# Altium schematic sheet Sheet3.SchDoc
size A3; SheetNumber: 3
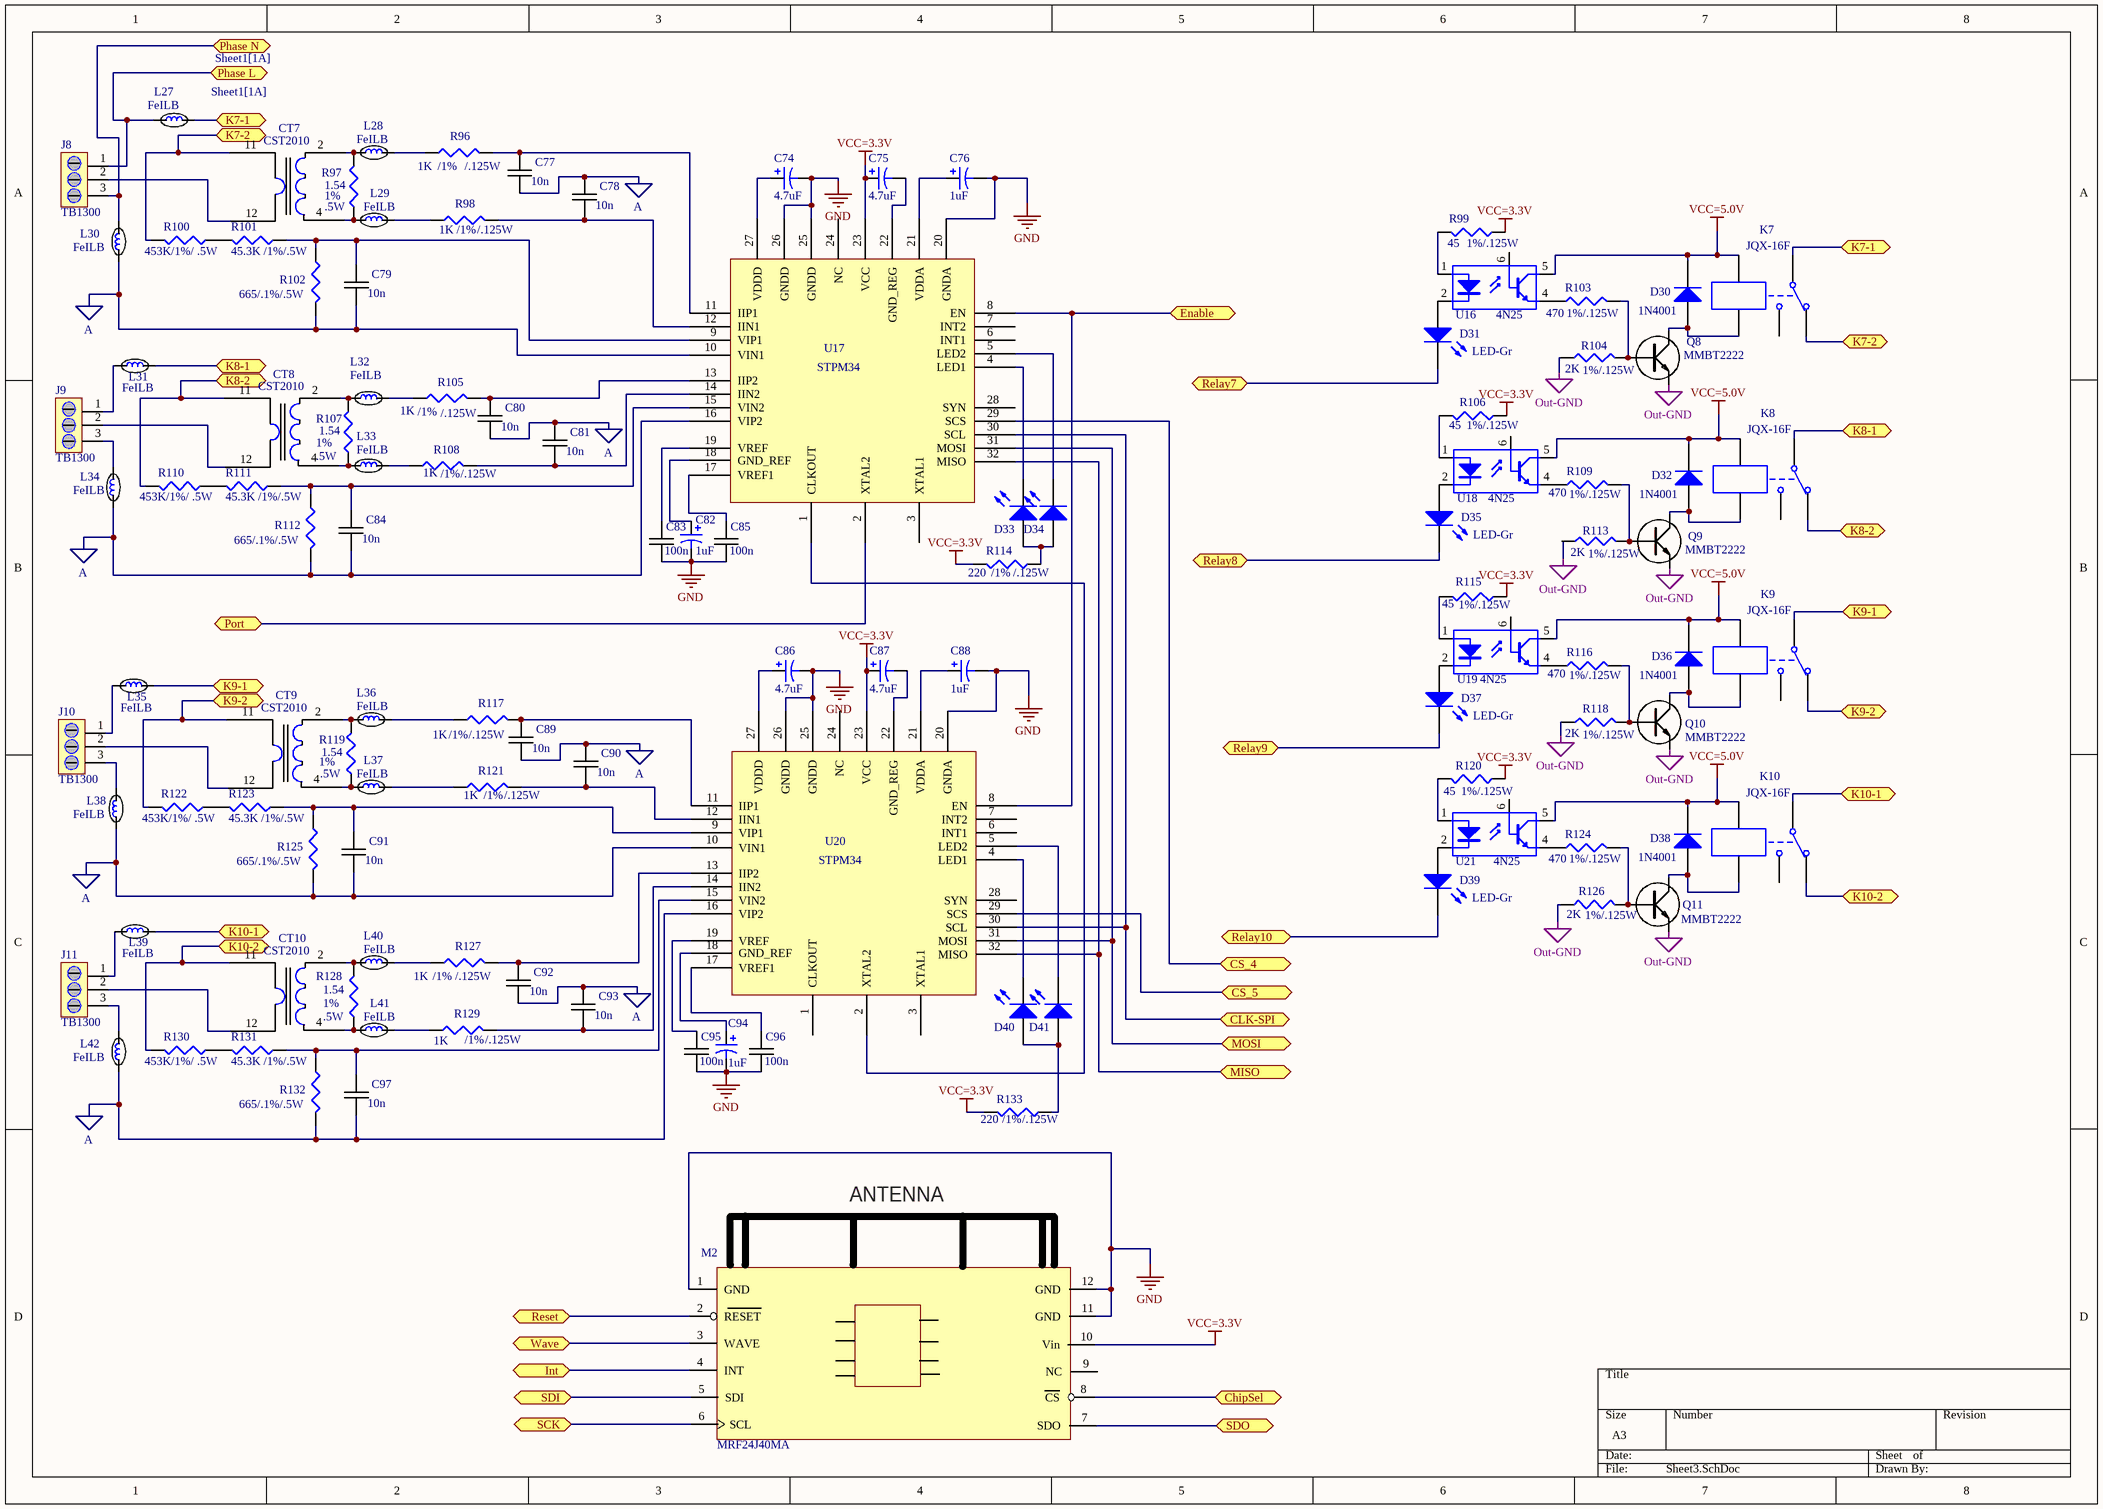
[diagram p0: Sheet3.SchDoc]

## Parts
C74  4.7uF  [C0805]
C75  4.7uF  [C0805]
C76  1uF  [C0805]
C77  10n  [0805C-TBD]
C78  10n  [0805C-TBD]
C79  10n  [0805C-TBD]
C80  10n  [0805C-TBD]
C81  10n  [0805C-TBD]
C82  1uF  [C0805]
C83  100n  [0805C-TBD]
C84  10n  [0805C-TBD]
C85  100n  [0805C-TBD]
C86  4.7uF  [C0805]
C87  4.7uF  [C0805]
C88  1uF  [C0805]
C89  10n  [0805C-TBD]
C90  10n  [0805C-TBD]
C91  10n  [0805C-TBD]
C92  10n  [0805C-TBD]
C93  10n  [0805C-TBD]
C94  1uF  [C0805]
C95  100n  [0805C-TBD]
C96  100n  [0805C-TBD]
C97  10n  [0805C-TBD]
CT7  CST2010  [CST2010]
CT8  CST2010  [CST2010]
CT9  CST2010  [CST2010]
CT10  CST2010  [CST2010]
D30  1N4001  [DO-214AC]
D31  LED-Gr  [3.2X1.6X1.1]
D32  1N4001  [DO-214AC]
D33  LED2  [3.2X1.6X1.1]  (value not drawn)
D34  LED2  [3.2X1.6X1.1]  (value not drawn)
D35  LED-Gr  [3.2X1.6X1.1]
D36  1N4001  [DO-214AC]
D37  LED-Gr  [3.2X1.6X1.1]
D38  1N4001  [DO-214AC]
D39  LED-Gr  [3.2X1.6X1.1]
D40  LED2  [3.2X1.6X1.1]  (value not drawn)
D41  LED2  [3.2X1.6X1.1]  (value not drawn)
J8  TB1300  [TB-1300-0-C]
J9  TB1300  [TB-1300-0-C]
J10  TB1300  [TB-1300-0-C]
J11  TB1300  [TB-1300-0-C]
K7  JQX-16F  [JQX-16f]
K8  JQX-16F  [JQX-16f]
K9  JQX-16F  [JQX-16f]
K10  JQX-16F  [JQX-16f]
L27  FeILB
L28  FeILB
L29  FeILB
L30  FeILB
L31  FeILB
L32  FeILB
L33  FeILB
L34  FeILB
L35  FeILB
L36  FeILB
L37  FeILB
L38  FeILB
L39  FeILB
L40  FeILB
L41  FeILB
L42  FeILB
M2  MRF24J40MA
Q8  MMBT2222  [SOT23-BCE]
Q9  MMBT2222  [SOT23-BCE]
Q10  MMBT2222  [SOT23-BCE]
Q11  MMBT2222  [SOT23-BCE]
R96  1K  [0805R-10]
R97  1.54  [0805R-10]
R98  1K  [0805R-10]
R99  45  [0805R-68]
R100  453K/1%/ .5W  [1210R-GENERIC]
R101  45.3K /1%/.5W  [1210C-GENERIC]
R102  665/.1%/.5W  [1210C-GENERIC]
R103  470  [0805R-39]
R104  2K  [0805R-180]
R105  1K  [0805R-10]
R106  45  [0805R-68]
R107  1.54  [0805R-10]
R108  1K  [0805R-10]
R109  470  [0805R-39]
R110  453K/1%/ .5W  [1210R-GENERIC]
R111  45.3K /1%/.5W  [1210C-GENERIC]
R112  665/.1%/.5W  [1210C-GENERIC]
R113  2K  [0805R-180]
R114  220  [J1-0603]
R115  45  [0805R-68]
R116  470  [0805R-39]
R117  1K  [0805R-10]
R118  2K  [0805R-180]
R119  1.54  [0805R-10]
R120  45  [0805R-68]
R121  1K  [0805R-10]
R122  453K/1%/ .5W  [1210R-GENERIC]
R123  45.3K /1%/.5W  [1210C-GENERIC]
R124  470  [0805R-39]
R125  665/.1%/.5W  [1210C-GENERIC]
R126  2K  [0805R-180]
R127  1K  [0805R-10]
R128  1.54  [0805R-10]
R129  1K  [0805R-10]
R130  453K/1%/ .5W  [1210R-GENERIC]
R131  45.3K /1%/.5W  [1210C-GENERIC]
R132  665/.1%/.5W  [1210C-GENERIC]
R133  220  [J1-0603]
U16  4N25  [4N25]
U17  STPM34  [QFN32_M]
U18  4N25  [4N25]
U19  4N25  [4N25]
U20  STPM34  [QFN32_M]
U21  4N25  [4N25]

## Ports
ChipSel, CLK-SPI, CS_4, CS_5, Enable, Int, K7-1, K7-2, K8-1, K8-2, K9-1, K9-2, K10-1, K10-2, MISO, MOSI, Phase L (see Sheet1[1A]), Phase N (see Sheet1[1A]), Port, Relay7, Relay8, Relay9, Relay10, Reset, SCK, SDI, SDO, Wave

## Nets
A: C77.1 C78.2 C79.1 C80.1 C81.2 C84.1 C89.1 C90.2 C91.1 C92.1 C93.2 C97.1 L30.1 L34.1 L38.1 L42.1 R102.2 R125.2 R132.2 U17.10(VIN1) U17.16(VIP2) U20.10(VIN1) U20.16(VIP2)
GND: C74.2 C76.2 C82.2 C83.1 C85.1 C86.2 C88.2 C94.2 C95.1 C96.1 M2.1(GND) M2.11(GND) M2.12(GND) U17.20(GNDA) U17.25(GNDD) U17.26(GNDD) U20.20(GNDA) U20.25(GNDD) U20.26(GNDD)
Out-GND: Q8.E Q9.E Q10.E Q11.E R104.1 R113.1 R118.1 R126.1
VCC=3.3V: C75.1 C87.1 M2.10(Vin) R99.1 R106.1 R114.2 R115.1 R120.1 R133.2 U17.23(VCC) U20.23(VCC)
VCC=5.0V: D30.2(K) D32.2(K) D36.2(K) D38.2(K) K7.4 K8.4 K9.4 K10.4 U16.5(C) U18.5(C) U19.5(C) U21.5(C)
ChipSel: M2.8(CS) ; port ChipSel
CLK-SPI: U17.30(SCL) U20.30(SCL) ; port CLK-SPI
CS_4: U17.29(SCS) ; port CS_4
CS_5: U20.29(SCS) ; port CS_5
Enable: U17.8(EN) U20.8(EN) ; port Enable
Int: M2.4(INT) ; port Int
K7-1: K7.1 L27.2 ; port K7-1
K7-2: CT7.11 K7.2 R100.2 ; port K7-2
K8-1: K8.1 L31.2 ; port K8-1
K8-2: CT8.11 K8.2 R110.2 ; port K8-2
K9-1: K9.1 L35.2 ; port K9-1
K9-2: CT9.11 K9.2 R122.2 ; port K9-2
K10-1: K10.1 L39.2 ; port K10-1
K10-2: CT10.11 K10.2 R130.2 ; port K10-2
MISO: U17.32(MISO) U20.32(MISO) ; port MISO
MOSI: U17.31(MOSI) U20.31(MOSI) ; port MOSI
Phase L: J8.1 L27.1 ; port Phase L
Phase N: J8.3 L30.2 ; port Phase N
Port: U17.2(XTAL2) ; port Port
Relay7: D31.2(K) ; port Relay7
Relay8: D35.2(K) ; port Relay8
Relay9: D37.2(K) ; port Relay9
Relay10: D39.2(K) ; port Relay10
Reset: M2.2(RESET) ; port Reset
SCK: M2.6(SCL) ; port SCK
SDI: M2.5(SDI) ; port SDI
SDO: M2.7(SDO) ; port SDO
Wave: M2.3(WAVE) ; port Wave
NetC74_1: C74.1 U17.27(VDDD)
NetC75_2: C75.2 U17.22(GND_REG)
NetC76_1: C76.1 U17.21(VDDA)
NetC77_2: C77.2 R96.2 U17.11(IIP1)
NetC78_1: C78.1 R98.2 U17.12(IIN1)
NetC79_2: C79.2 R101.1 R102.1 U17.9(VIP1)
NetC80_2: C80.2 R105.2 U17.13(IIP2)
NetC81_1: C81.1 R108.2 U17.14(IIN2)
NetC82_1: C82.1 U17.18(GND_REF)
NetC83_2: C83.2 U17.19(VREF)
NetC84_2: C84.2 R111.1 R112.1 U17.15(VIN2)
NetC85_2: C85.2 U17.17(VREF1)
NetC86_1: C86.1 U20.27(VDDD)
NetC87_2: C87.2 U20.22(GND_REG)
NetC88_1: C88.1 U20.21(VDDA)
NetC89_2: C89.2 R117.2 U20.11(IIP1)
NetC90_1: C90.1 R121.2 U20.12(IIN1)
NetC91_2: C91.2 R123.1 R125.1 U20.9(VIP1)
NetC92_2: C92.2 R127.2 U20.13(IIP2)
NetC93_1: C93.1 R129.2 U20.14(IIN2)
NetC94_1: C94.1 U20.18(GND_REF)
NetC95_2: C95.2 U20.19(VREF)
NetC96_2: C96.2 U20.17(VREF1)
NetC97_2: C97.2 R131.1 R132.1 U20.15(VIN2)
NetCT7_2: CT7.2 L28.1 R97.2
NetCT7_4: CT7.4 L29.1 R97.1
NetCT7_12: CT7.12 J8.2
NetCT8_2: CT8.2 L32.1 R107.2
NetCT8_4: CT8.4 L33.1 R107.1
NetCT8_12: CT8.12 J9.2
NetCT9_2: CT9.2 L36.1 R119.2
NetCT9_4: CT9.4 L37.1 R119.1
NetCT9_12: CT9.12 J10.2
NetCT10_2: CT10.2 L40.1 R128.2
NetCT10_4: CT10.4 L41.1 R128.1
NetCT10_12: CT10.12 J11.2
NetD30_1: D30.1(A) K7.5 Q8.C
NetD31_1: D31.1(A) U16.2(K)
NetD32_1: D32.1(A) K8.5 Q9.C
NetD33_1: D33.1(A) D34.1(A) R114.1
NetD33_2: D33.2(K) U17.4(LED1)
NetD34_2: D34.2(K) U17.5(LED2)
NetD35_1: D35.1(A) U18.2(K)
NetD36_1: D36.1(A) K9.5 Q10.C
NetD37_1: D37.1(A) U19.2(K)
NetD38_1: D38.1(A) K10.5 Q11.C
NetD39_1: D39.1(A) U21.2(K)
NetD40_1: D40.1(A) D41.1(A) R133.1
NetD40_2: D40.2(K) U20.4(LED1)
NetD41_2: D41.2(K) U20.5(LED2)
NetJ9_1: J9.1 L31.1
NetJ9_3: J9.3 L34.2
NetJ10_1: J10.1 L35.1
NetJ10_3: J10.3 L38.2
NetJ11_1: J11.1 L39.1
NetJ11_3: J11.3 L42.2
NetL28_2: L28.2 R96.1
NetL29_2: L29.2 R98.1
NetL32_2: L32.2 R105.1
NetL33_2: L33.2 R108.1
NetL36_2: L36.2 R117.1
NetL37_2: L37.2 R121.1
NetL40_2: L40.2 R127.1
NetL41_2: L41.2 R129.1
NetQ8_B: Q8.B R103.2 R104.2
NetQ9_B: Q9.B R109.2 R113.2
NetQ10_B: Q10.B R116.2 R118.2
NetQ11_B: Q11.B R124.2 R126.2
NetR99_2: R99.2 U16.1(A)
NetR100_1: R100.1 R101.2
NetR103_1: R103.1 U16.4(E)
NetR106_2: R106.2 U18.1(A)
NetR109_1: R109.1 U18.4(E)
NetR110_1: R110.1 R111.2
NetR115_2: R115.2 U19.1(A)
NetR116_1: R116.1 U19.4(E)
NetR120_2: R120.2 U21.1(A)
NetR122_1: R122.1 R123.2
NetR124_1: R124.1 U21.4(E)
NetR130_1: R130.1 R131.2
NetU17_1: U17.1(CLKOUT) U20.2(XTAL2)

Not connected (* = marked no-connect by the designer): K7 3; K8 3; K9 3; K10 3; M2 9(NC); R112 2; U16 6(B); U17 3(XTAL1) 6(INT1) 7(INT2) 24(NC) 28(SYN); U18 6(B); U19 6(B); U20 1(CLKOUT) 3(XTAL1) 6(INT1) 7(INT2) 24(NC) 28(SYN); U21 6(B)

## Notes on the sheet
- (near R96) /1%
- (near R96) /.125W
- 1%
- .5W
- (near R98) /1%
- (near R98) /.125W
- (near R99) 1%/.125W
- (near R103) 1%/.125W
- 1%/.125W
- (near R105) /1%
- /.125W
- (near R106) 1%/.125W
- (near R108) /1%
- (near R108) /.125W
- (near R109) 1%/.125W
- (near R114) /1%
- (near R114) /.125W
- (near R115) 1%/.125W
- (near R116) 1%/.125W
- (near R117) /1%
- (near R121) /1%
- (near R121) /.125W
- (near R124) 1%/.125W
- (near R127) /1%
- (near R127) /.125W
- (near R129) /1%
- (near R129) /.125W
- (near R133) /1%
- (near R133) /.125W
- (in symbol MRF24J40MA) ANTENNA

## Library data of the parts
C74 C75 C86 C87 = Cap Pol3: Polarized Capacitor (Surface Mount); Manufacturer: Kemet; Mfr.PN#: T491A106K006AT7280; Value: 100pF; Suppl.PN#: 399-10116-ND; Published: 8-Jun-2000; LatestRevisionDate: 29-May-2009; LatestRevisionNote: IPC-7351 Footprint Added.; PackageReference: C0805; Publisher: Altium Limited; PackageDescription: Chip Capacitor; Supplier: Digi-Key; SMD: 1206; Price: .065
C76 C82 C88 C94 = Cap Pol3: Polarized Capacitor (Surface Mount); Manufacturing: Vishay  Spraque; Mfr.PN#: 298D105X06R3k2T; Value: 100pF; Suppl.PN#: 298D105X06R3k2T-ND; Published: 8-Jun-2000; LatestRevisionDate: 29-May-2009; LatestRevisionNote: IPC-7351 Footprint Added.; PackageReference: C0805; Publisher: Altium Limited; PackageDescription: Chip Capacitor; Supplier: Digi-Key; SMD: 0402; Price: .4
C77-C81 C84 C89-C93 C97 = 0805C-18PF-50V-C0G-JOH: CAPACITOR 0805 CERAMIC; Manufacturer: Murata Electronics; Mfr.PN#: CRM155R71H103KA880; Suppl.PN#: 490-4516-2-ND; Supplier 1: Digi-Key; Supplier Part Number 1: 709-1171-2-ND; Value: 10n; mfr PN: *; Package reference: 0805-TBD; Supplier: Digi-Key; smd: 0402; Price: .002
C83 C85 C95 C96 = 0805C-18PF-50V-C0G-JOH: CAPACITOR 0805 CERAMIC; Manufacturer: Murata Electronnics; Mfr.PN#: GRM155R61A104KA01; Value: 10n; Suppl.PN#: 490-1318-2-ND; Pprice: 0.0021; Supplier 1: Digi-Key; Supplier Part Number 1: 709-1171-2-ND; mfr PN: *; Package reference: 0805-TBD; Supplier: Digi-Key; SMD: 0402
CT7-CT10 = CurrentTransf: Manufacturer: Coilcraft; Mfr.PN#: CST2010-200L; Price: 1.14
D30 D32 D36 D38 = Diode 1N4001: 1 Amp General Purpose Rectifier; Manufacturer: Diode Incorporated; Mfr.PN#: S1AB-13; Suppl.PN#: S1ABD1TR-ND; Published: 8-Jun-2000; LatestRevisionDate: 17-Jul-2002; LatestRevisionNote: Re-released for DXP Platform.; DatasheetVersion: 1998; PackageVersion: Aug-1999; PackageReference: DO-41; Publisher: Altium Limited; PackageDescription: Diode, Axial; Body 5.2 x 2.7 mm (LxDia. max), Lead Dia. 0.86 mm (max); Code_JEDEC: DO-204-AL; ComponentLink1Description: Manufacturer Link; ComponentLink1URL: http://www.fairchildsemi.com/; ComponentLink2Description: Datasheet; ComponentLink2URL: http://www.fairchildsemi.com/ds/1N%2F1N4001.pdf; Supplier: Digi-Key; Price: .1
D31 D35 D37 D39 = LED2: Typical RED, GREEN, YELLOW, AMBER GaAs LED; Manufacturer: Lite-On Inc; Mfr.PN#: LTST-C191KGKT; Suppl.PN#: 160-1446-2-ND; Published: 8-Jun-2000; LatestRevisionDate: 17-Jul-2002; LatestRevisionNote: Re-released for DXP Platform.; PackageVersion: Feb-2002; PackageReference: 3.2X1.6X1.1; Publisher: Altium Limited; PackageDescription: SM LED; 2 Flat Leads; Supplier: Digi-Key; Price: .04
D33 D34 D40 D41 = LED2: Typical RED, GREEN, YELLOW, AMBER GaAs LED; Manufacturer: Lite-On Inc; Mfr.PN#: LTST-C191KRKT; Suppl.PN#: 160-1447-2-ND; Published: 8-Jun-2000; LatestRevisionDate: 17-Jul-2002; LatestRevisionNote: Re-released for DXP Platform.; PackageVersion: Feb-2002; PackageReference: 3.2X1.6X1.1; Publisher: Altium Limited; PackageDescription: SM LED; 2 Flat Leads; Price: .04; Supplier: Digi-Key
J8-J11 = TermBlock-2: Manufacturer: SCED Electronics Co.Ltd China; Mfr.PN#: TB1300-00-C; Price: .3
K7-K10 = Relay-SPDT: Single-Pole Dual-Throw Relay; Manufacturer: YUEQING HENGWEI Electronics CO,Ltd; Mfr.PN#: JQX-16F(T91)30A1CDC5; Published: 24-Mar-1999; LatestRevisionDate: 17-Jul-2002; LatestRevisionNote: Re-released for DXP Platform.; PackageReference: MODULE5B; Publisher: Altium Limited; Supplier: Shanghai Shinvo Electric Co.Ltd; Price: .2
L27-L42 = FerrBeads/ILBB: Manufacturer: Brand Samsung; Mfr.PN#: C1M10J152NC; Suppl.PN#: 1276-6326-1-ND; Supplier: Digi-Key; Price: .027
M2 = MRF24J40MA: Manufacturer: Microchip; Mfr.PN#: MRF24J40M-I/RM; Suppl.PN#: MRF24J40M-I/RMCT-ND; Supplier: Digi-Key; Price: 6.08
Q8-Q11 = MMBT2222: BC847 SMALL SIGNAL NPN TRANSISTOR; Manufacturer: Diodes  Inc.; Mfr.PN#: MMBT2222A-7-F; Suppl.PN#: MMBT2222A-FDICT-ND; Supplier 1: Digi-Key; Supplier Part Number 1: MMBT2222A-FDICT-ND; Supplier: Digi-Key; Package: SOT-323; Price: .03
R96 R98 R105 R108 R117 R121 R127 R129 = Res3: Resistor; Manufacturer: Stackpole Electronics; Mfr.PN#: RNCP1206FTD1K00; Value: 1K 1%; Suppl.PN#: RNCP1206FTD1K00TR-ND; Published: 8-Jun-2000; LatestRevisionDate: 29-May-2009; LatestRevisionNote: IPC-7351 Footprint Added.; PackageReference: J1-0603; Publisher: Altium Limited; PackageDescription: Chip Resistor; Supplier: Digi-Key; Price: .05
R97 R107 R119 R128 = Res3: Resistor; Manufacturer: Vishay Pale; Mfr.PN#: CR0W12061R54FKEAHP; Value: 1K 1%; Suppl.PN#: 541-1.54UTR-ND; Published: 8-Jun-2000; LatestRevisionDate: 29-May-2009; LatestRevisionNote: IPC-7351 Footprint Added.; PackageReference: J1-0603; Publisher: Altium Limited; PackageDescription: Chip Resistor; Supplier: Digi-Key; Price: .05; SMD: 1206
R99 R106 R115 R120 = Res3: Resistor; Manufacrturer: Vishay Dale; Mfr.PN#: CRCW080545R0FKTA; Value: 45/.125/1%; Suppl.PN#: CRCW080545R0FKTA-ND; Published: 8-Jun-2000; LatestRevisionDate: 29-May-2009; LatestRevisionNote: IPC-7351 Footprint Added.; PackageReference: J1-0603; Publisher: Altium Limited; PackageDescription: Chip Resistor; mfr PN: *; Supplier: Digi-Key
R100 R110 R122 R130 = Res3: Resistor; Manufacturer: Panasonic  Co; Mfr.PN#: ERJ-P14F4533U; Value: 175k/ .5 W 1%; Suppl.PN#: P16125TR-ND; Published: 8-Jun-2000; LatestRevisionDate: 29-May-2009; LatestRevisionNote: IPC-7351 Footprint Added.; PackageReference: J1-0603; Publisher: Altium Limited; PackageDescription: Chip Resistor; mfr PN: *; Package Reference: 1206; Supplier: Digi-Key; SMD: 1210; Price: .055
R101 R111 R123 R131 = Res3: Resistor; Manufacturer: Panasonic Co; Mfr.PN#: ERJ-14NF-4532U; Value: 100k /.5 W 1%; Suppl.PN#: P45.3KAATR-ND; Published: 8-Jun-2000; LatestRevisionDate: 29-May-2009; LatestRevisionNote: IPC-7351 Footprint Added.; PackageReference: J1-0603; Publisher: Altium Limited; PackageDescription: Chip Resistor; mfr PN: *; Package Reference: 1206; Supplier: Digi-key; SMD: 1210; Price: .035
R102 R112 R125 R132 = Res3: Resistor; Manufacturer: Panasonic Co; Mfr.PN#: ERJ-P06F6650V; Value: 3 .125W 1%; Suppl.PN#: P16076TR-ND; Published: 8-Jun-2000; LatestRevisionDate: 29-May-2009; LatestRevisionNote: IPC-7351 Footprint Added.; PackageReference: J1-0603; Publisher: Altium Limited; PackageDescription: Chip Resistor; Supplier: Digi-Key; SMD: 0805; Price: .02
R103 R109 R116 R124 = Res3: Resistor; Manufacturer: Stackpole electronics; Mfr.PN#: RMCF0805FT470R; Value: 470/.125W/1%; Suppl.PN#: RMCF0805FT470RtR-ND; Published: 8-Jun-2000; LatestRevisionDate: 29-May-2009; LatestRevisionNote: IPC-7351 Footprint Added.; PackageReference: J1-0603; Publisher: Altium Limited; PackageDescription: Chip Resistor; Supplier: Digi-Key; Price: .003
R104 R113 R118 R126 = Res3: Resistor; Manufacturer: Stackpole Electronics; Mfr.PN#: RMCF0805FT2K00; Value: 2K/.125W/1%; Suppl.PN#: RMCF0805FT2K00-ND; Published: 8-Jun-2000; LatestRevisionDate: 29-May-2009; LatestRevisionNote: IPC-7351 Footprint Added.; PackageReference: J1-0603; Publisher: Altium Limited; PackageDescription: Chip Resistor; Supplier: Digi-Key; Price: .033
R114 R133 = Res3: Resistor; Manufacturer: Stackpole Electronics; Mfr.PN#: RMCF0805FT220R; Value: 1K 1%; Suppl.PN#: RMCF0805FT220RTR-ND; Published: 8-Jun-2000; LatestRevisionDate: 29-May-2009; LatestRevisionNote: IPC-7351 Footprint Added.; PackageReference: J1-0603; Publisher: Altium Limited; PackageDescription: Chip Resistor; manufacture P/N: *; Supplier: Digi-Key; Price: .0027
U16 U18 U19 U21 = Optoisolator2: 5 Pin Mini Flat Pack Optocoupler; Manufacturer: Avago Technologies; Mfr.PN#: 4N25-300E; Suppl.PN#: 4N25-300; Published: 24-Mar-1999; LatestRevisionDate: 04-Mar-2005; LatestRevisionNote: PCB Footprint replaced, Sch pins re-numbered.; DatasheetVersion: Apr-2004; PackageReference: SOP5(6); Publisher: Altium Limited; PackageDescription: Small Outline; 6 Leads (1 Absent); Body Width 4.4 mm; Pitch 1.27 mm; Supplier: Arrow; Price: .1273
U17 U20 = STPM34: Manufacturer: STMicroelectronic; Mfr.PN#: STPM34TR; Suppl.PN#: 497-14670-1-ND; Supplier: Digi-Key; Price: 1.16